# EAGLE schematic test (EAGLE 7.2.0)
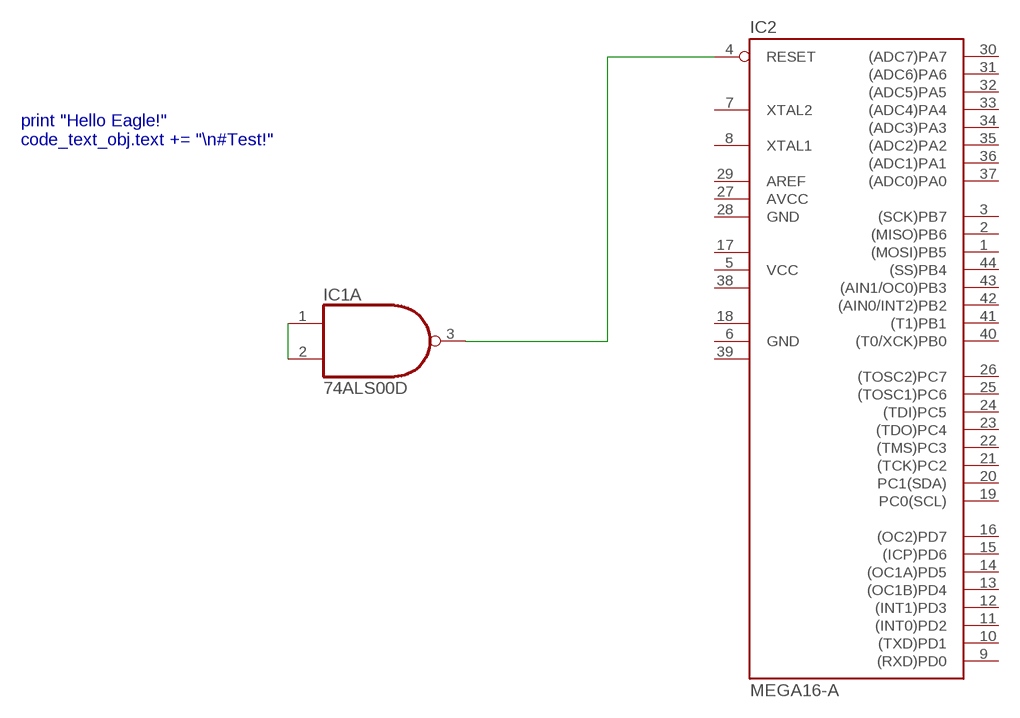
[diagram p0: schematic, sheet 1]

## Parts
IC1  74ALS00D  [SO14]
IC2  MEGA16-A  [TQFP44]

## Nets
N$1: IC1.1(A:I0) IC1.2(A:I1)
N$2: IC1.3(A:O) IC2.4(RESET)
Unconnected: IC1.4(B:I0) IC1.5(B:I1) IC1.6(B:O) IC1.8(C:O) IC1.9(C:I0) IC1.10(C:I1) IC1.11(D:O) IC1.12(D:I0) IC1.13(D:I1) IC2.1((MOSI)PB5) IC2.2((MISO)PB6) IC2.3((SCK)PB7) IC2.7(XTAL2) IC2.8(XTAL1) IC2.9((RXD)PD0) IC2.10((TXD)PD1) IC2.11((INT0)PD2) IC2.12((INT1)PD3) IC2.13((OC1B)PD4) IC2.14((OC1A)PD5) IC2.15((ICP)PD6) IC2.16((OC2)PD7) IC2.19(PC0(SCL)) IC2.20(PC1(SDA)) IC2.21((TCK)PC2) IC2.22((TMS)PC3) IC2.23((TDO)PC4) IC2.24((TDI)PC5) IC2.25((TOSC1)PC6) IC2.26((TOSC2)PC7) IC2.29(AREF) IC2.30((ADC7)PA7) IC2.31((ADC6)PA6) IC2.32((ADC5)PA5) IC2.33((ADC4)PA4) IC2.34((ADC3)PA3) IC2.35((ADC2)PA2) IC2.36((ADC1)PA1) IC2.37((ADC0)PA0) IC2.40((T0/XCK)PB0) IC2.41((T1)PB1) IC2.42((AIN0/INT2)PB2) IC2.43((AIN1/OC0)PB3) IC2.44((SS)PB4)

## Notes on the sheet
- print "Hello Eagle!"
  code_text_obj.text += "\n#Test!"

## Power pins joined to a net without a drawn wire
AVCC: IC2.27(AVCC)
GND: IC1.7(P:GND) IC2.6(GND) IC2.28(GND)
GND1: IC2.18(GND1)
GND2: IC2.39(GND2)
VCC: IC1.14(P:VCC) IC2.5(VCC)
VCC1: IC2.17(VCC1)
VCC2: IC2.38(VCC2)

## Library data of the parts
IC1 = 74xx-us:74*00: Quad 2-input NAND gate
IC2 = atmel:MEGA16: MICROCONTROLLER 16 Kbytes FLASH 1 kbytes SRAM 512 bytes EEPROM USART 8-channel 10 bit ADC Source: avr.lbr; MPN: ATMEGA16-16AU; OC_FARNELL: 9171134; OC_NEWARK: 96K6515